# EAGLE design pypl_v1.4 (EAGLE 9.6.2)
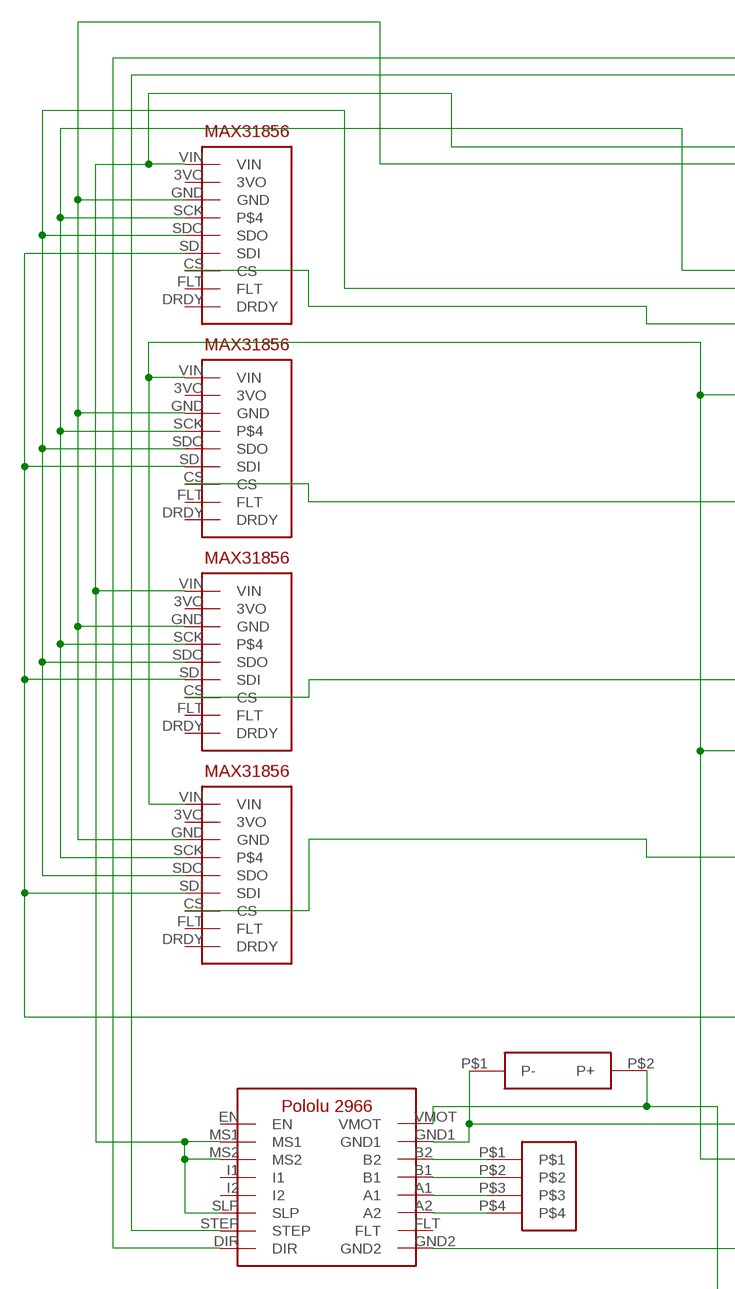
[diagram p0: schematic, sheet 1, part 1 of 2]
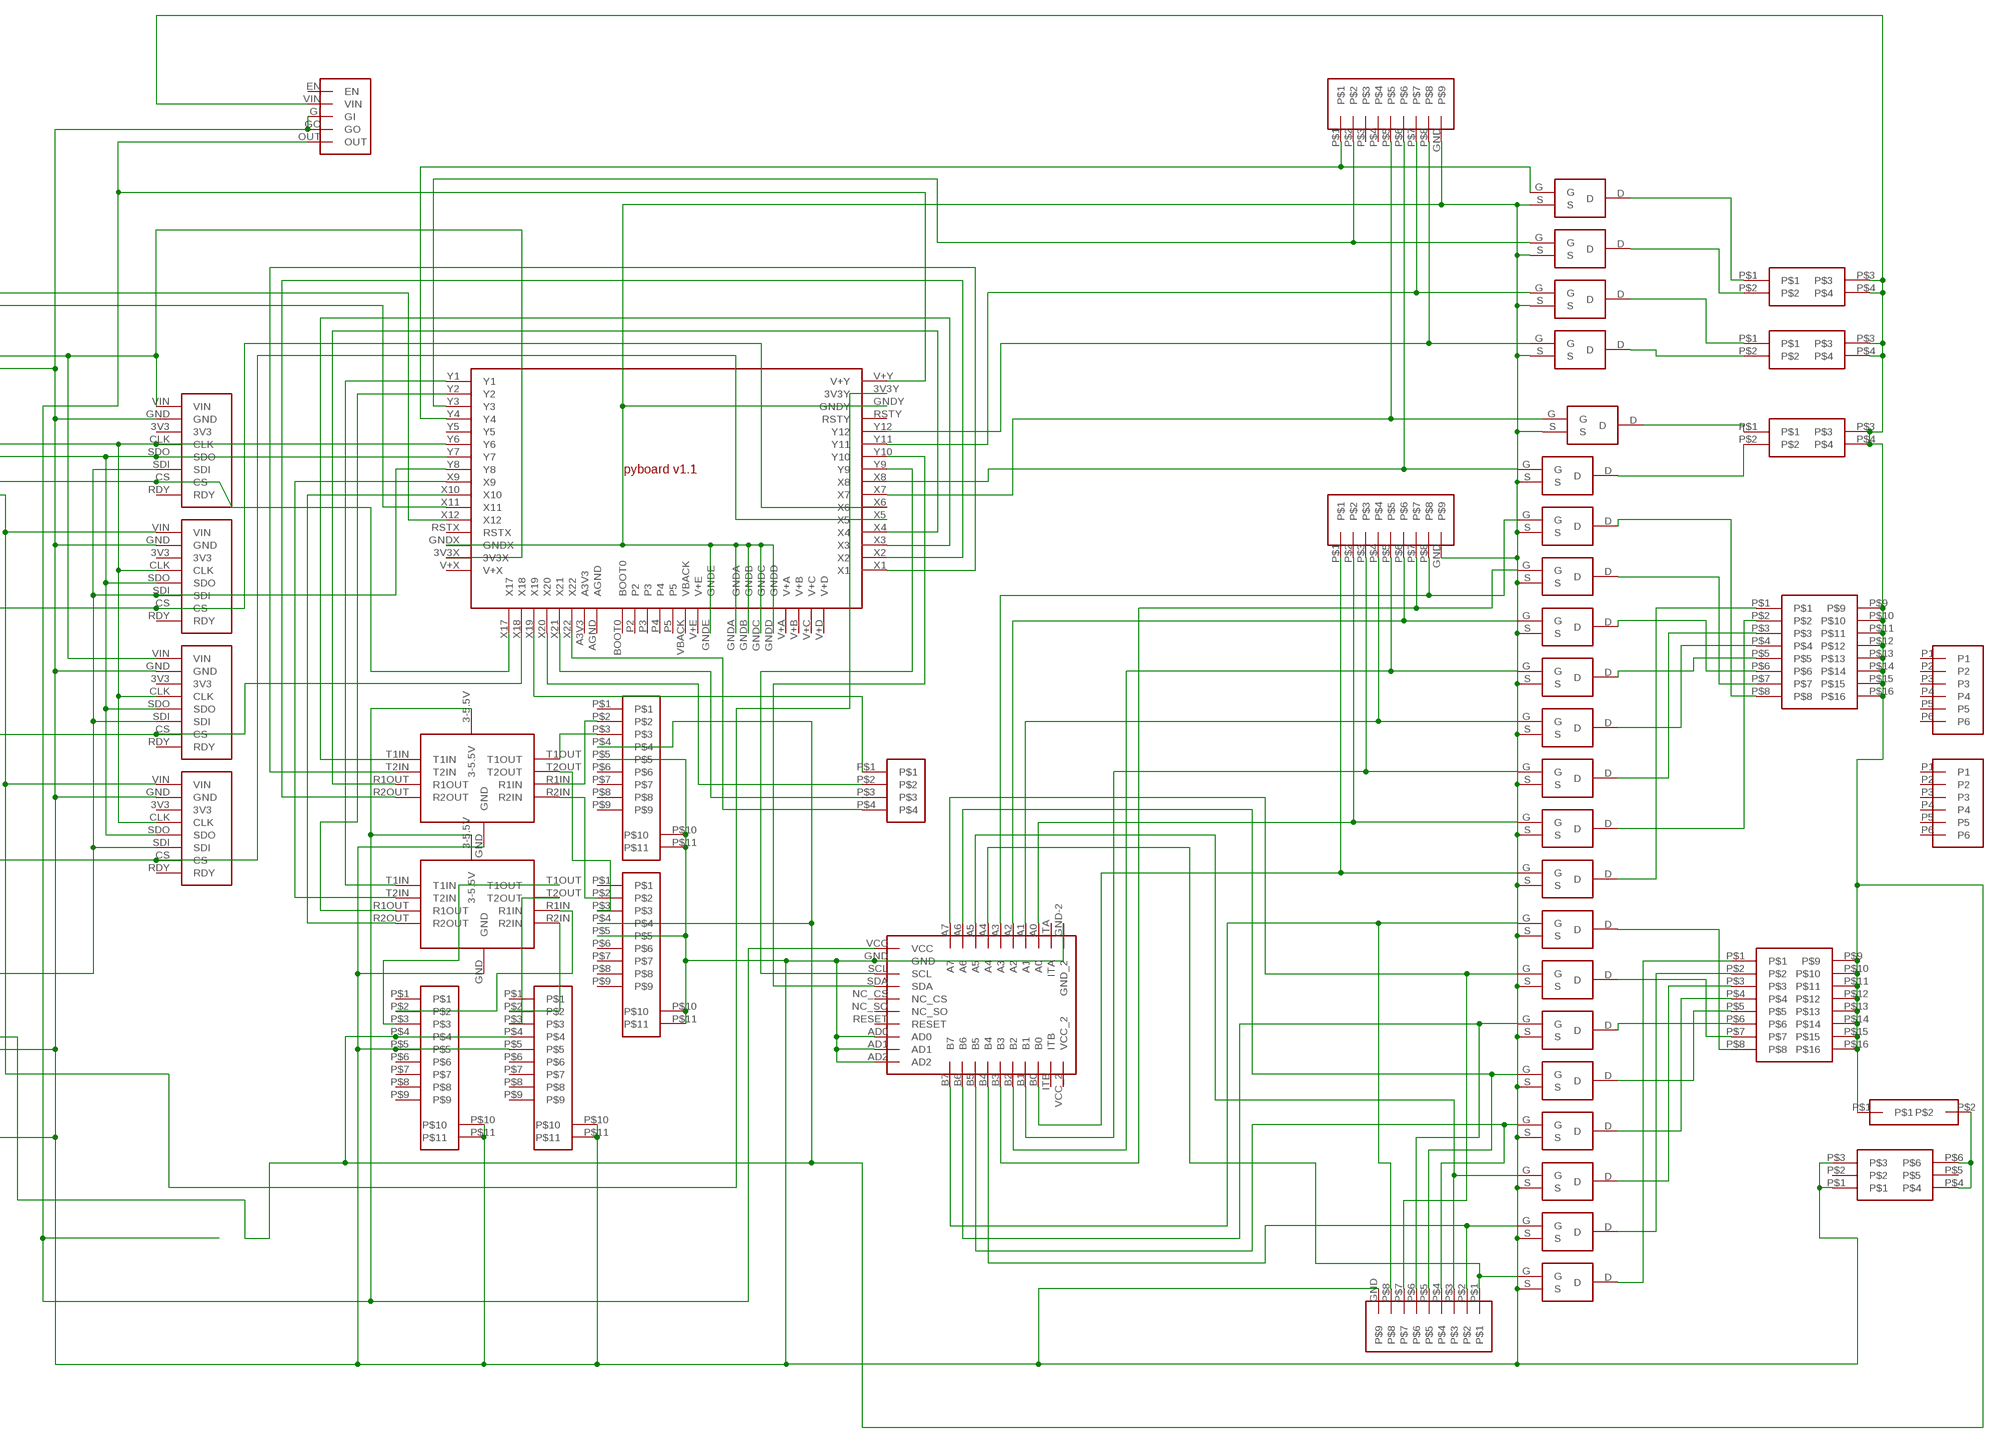
[diagram p1: schematic, sheet 1, part 2 of 2]

## Parts
U$1  MAX31865  [MAX31865]
U$2  IRLB8721PBF  [IRLB8721PBF]
U$3  IRLB8721PBF  [IRLB8721PBF]
U$4  IRLB8721PBF  [IRLB8721PBF]
U$5  IRLB8721PBF  [IRLB8721PBF]
U$6  IRLB8721PBF  [IRLB8721PBF]
U$7  IRLB8721PBF  [IRLB8721PBF]
U$8  IRLB8721PBF  [IRLB8721PBF]
U$9  IRLB8721PBF  [IRLB8721PBF]
U$10  MCP23017  [MCP23017]
U$11  IRLB8721PBF  [IRLB8721PBF]
U$12  IRLB8721PBF  [IRLB8721PBF]
U$13  IRLB8721PBF  [IRLB8721PBF]
U$14  IRLB8721PBF  [IRLB8721PBF]
U$15  IRLB8721PBF  [IRLB8721PBF]
U$16  IRLB8721PBF  [IRLB8721PBF]
U$17  IRLB8721PBF  [IRLB8721PBF]
U$18  IRLB8721PBF  [IRLB8721PBF]
U$19  DSUB-9  [DSUB-9]
U$20  DSUB-9  [DSUB-9]
U$21  DSUB-9  [DSUB-9]
U$22  DSUB-9  [DSUB-9]
U$23  MAX31865  [MAX31865]
U$24  PYBOARD_V1.1  [PYBOARD_V1.1]
U$25  MAX31865  [MAX31865]
U$26  MAX31865  [MAX31865]
U$27  BORNIER_DUPLEX_X16  [BORNIER_DUPLEX_X16]
U$28  BORNIER_DUPLEX_X16  [BORNIER_DUPLEX_X16]
U$29  CAP-GOTRONIC-04936  [CAP-GOTRONIC-04936]
U$30  BORNIER_1X4_2.54  [BORNIER_1X4_2.54]
U$31  PORTE-FUSIBLE  [PORTE-FUSIBLE]
U$32  MP6500-2966  [MP6500-2966]
U$33  IRLB8721PBF  [IRLB8721PBF]
U$34  IRLB8721PBF  [IRLB8721PBF]
U$35  BORNIER_DUPLEX_X4  [BORNIER_DUPLEX_X4]
U$36  BOB-1189  [BOB-11189]
U$37  BOB-1189  [BOB-11189]
U$38  MOLEX_MINIFT_JR_ANGLED_X6  [MOLEX_MINIFT_JR_ANGLED_X6]
U$39  D24V50F5D24V50F5  [D24V50F5]
U$40  BORNIER_DUPLEX_X4  [BORNIER_DUPLEX_X4]
U$41  BORNIER_DUPLEX_X4  [BORNIER_DUPLEX_X4]
U$42  IRLB8721PBF  [IRLB8721PBF]
U$43  IRLB8721PBF  [IRLB8721PBF]
U$44  IRLB8721PBF  [IRLB8721PBF]
U$45  IRLB8721PBF  [IRLB8721PBF]
U$46  BORNIER_1X4_2.54  [BORNIER_1X4_2.54]
U$47  RESISTOR_BANK_BUSSED_X8  [RESISTOR_BANK_BUSSED_X8]
U$48  RESISTOR_BANK_BUSSED_X8  [RESISTOR_BANK_BUSSED_X8]
U$49  RESISTOR_BANK_BUSSED_X8  [RESISTOR_BANK_BUSSED_X8]
U$50  MAX31856  [MAX31856]
U$51  MAX31856  [MAX31856]
U$52  MAX31856  [MAX31856]
U$53  MAX31856  [MAX31856]
U$54  PINH06  [PINH06]
U$55  PINH06  [PINH06]

## Nets
GND: U$1.GND U$2.S U$3.S U$4.S U$5.S U$6.S U$7.S U$8.S U$9.S U$10.AD0 U$10.AD1 U$10.AD2 U$10.GND U$10.GND-2(GND_2) U$11.S U$12.S U$13.S U$14.S U$15.S U$16.S U$17.S U$18.S U$19.P$5 U$19.P$10 U$19.P$11 U$20.P$5 U$20.P$10 U$20.P$11 U$21.P$5 U$21.P$10 U$21.P$11 U$22.P$5 U$22.P$10 U$22.P$11 U$23.GND U$24.GNDA U$24.GNDB U$24.GNDC U$24.GNDD U$24.GNDE U$24.GNDX U$24.GNDY U$25.GND U$26.GND U$29.P$1(P-) U$32.GND1 U$32.GND2 U$33.S U$34.S U$36.GND U$37.GND U$38.P$1 U$38.P$3 U$39.GI U$39.GO U$42.S U$43.S U$44.S U$45.S U$47.GND U$48.GND U$49.GND U$50.GND U$51.GND U$52.GND U$53.GND
N$1: U$24.X12 U$32.DIR
N$2: U$10.SDA U$24.Y10
N$3: U$10.SCL U$24.Y9
N$4: U$24.X4 U$36.R1OUT
N$5: U$24.X3 U$36.T1IN
N$6: U$24.X2 U$36.R2OUT
N$7: U$24.X1 U$36.T2IN
N$8: U$24.Y1 U$37.T1IN
N$9: U$24.Y2 U$37.R1OUT
N$10: U$24.X10 U$37.R2OUT
N$11: U$24.X9 U$37.T2IN
N$12: U$1.CLK U$23.CLK U$24.Y6 U$25.CLK U$26.CLK U$50.SCK U$51.SCK U$52.SCK U$53.SCK
N$13: U$1.SDO U$23.SDO U$24.Y7 U$25.SDO U$26.SDO U$50.SDO U$51.SDO U$52.SDO U$53.SDO
N$14: U$1.SDI U$23.SDI U$24.Y8 U$25.SDI U$26.SDI U$50.SDI U$51.SDI U$52.SDI U$53.SDI
N$15: U$10.A7 U$15.G U$47.P$7
N$16: U$4.G U$10.B2 U$48.P$5
N$17: U$7.G U$10.A3 U$48.P$8
N$18: U$6.G U$10.B3 U$48.P$7
N$19: U$5.G U$10.A2 U$48.P$6
N$20: U$3.G U$10.A1 U$48.P$4
N$21: U$2.G U$10.B1 U$48.P$3
N$22: U$8.G U$10.A0 U$48.P$2
N$23: U$9.G U$10.B0 U$48.P$1
N$24: U$10.B4 U$17.G U$47.P$2
N$26: U$10.B5 U$12.G U$47.P$4
N$27: U$10.B6 U$14.G U$47.P$6
N$28: U$10.B7 U$16.G U$47.P$8
N$30: U$10.A6 U$13.G U$47.P$5
N$31: U$7.D U$28.P$8
N$32: U$6.D U$28.P$7
N$33: U$5.D U$28.P$6
N$34: U$30.P$1 U$32.B2
N$35: U$16.D U$27.P$8
N$36: U$15.D U$27.P$7
N$37: U$4.D U$28.P$5
N$38: U$3.D U$28.P$4
N$39: U$2.D U$28.P$3
N$40: U$8.D U$28.P$2
N$41: U$9.D U$28.P$1
N$42: U$14.D U$27.P$6
N$43: U$13.D U$27.P$5
N$44: U$12.D U$27.P$4
N$45: U$11.D U$27.P$3
N$46: U$17.D U$27.P$2
N$47: U$18.D U$27.P$1
N$48: U$24.X19 U$46.P$1
N$49: U$40.P$2 U$42.D
N$50: U$10.VCC U$24.V+Y U$36.3-5.5V U$37.3-5.5V U$39.OUT
N$51: U$31.P$2 U$38.P$4 U$38.P$6
N$52: U$24.X6 U$26.CS U$51.CS
N$53: U$1.CS U$24.X18 U$52.CS
N$54: U$24.X17 U$25.CS U$50.CS
N$55: U$24.X7 U$34.G U$49.P$5
N$56: U$24.X8 U$33.G U$49.P$6
N$57: U$33.D U$35.P$2
N$58: U$34.D U$35.P$1
N$59: U$30.P$2 U$32.B1
N$60: U$30.P$3 U$32.A1
N$61: U$30.P$4 U$32.A2
N$62: U$19.P$2 U$36.R1IN
N$63: U$20.P$2 U$36.R2IN
N$64: U$40.P$1 U$43.D
N$65: U$21.P$2 U$37.R2IN
N$66: U$22.P$2 U$37.R1IN
N$67: U$19.P$3 U$36.T1OUT
N$68: U$20.P$3 U$36.T2OUT
N$69: U$22.P$3 U$37.T1OUT
N$70: U$21.P$3 U$37.T2OUT
N$71: U$1.VIN U$24.3V3X U$25.VIN U$32.MS1 U$32.MS2 U$32.SLP U$50.VIN U$52.VIN
N$72: U$23.CS U$24.X5 U$53.CS
N$73: U$41.P$2 U$44.D
N$74: U$23.VIN U$24.3V3Y U$26.VIN U$51.VIN U$53.VIN
N$75: U$19.P$4 U$20.P$4 U$21.P$4 U$22.P$4 U$27.P$9 U$27.P$10 U$27.P$11 U$27.P$12 U$27.P$13 U$27.P$14 U$27.P$15 U$27.P$16 U$28.P$9 U$28.P$10 U$28.P$11 U$28.P$12 U$28.P$13 U$28.P$14 U$28.P$15 U$28.P$16 U$29.P$2(P+) U$31.P$1 U$32.VMOT U$35.P$3 U$35.P$4 U$39.VIN U$40.P$3 U$40.P$4 U$41.P$3 U$41.P$4
N$76: U$24.X20 U$46.P$2
N$77: U$24.X21 U$46.P$3
N$78: U$24.X22 U$46.P$4
N$79: U$24.X11 U$32.STEP
N$80: U$10.A5 U$11.G U$47.P$3
N$81: U$41.P$1 U$45.D
N$82: U$24.Y11 U$43.G U$49.P$7
N$83: U$24.Y12 U$42.G U$49.P$8
N$84: U$24.Y3 U$44.G U$49.P$2
N$85: U$24.Y4 U$45.G U$49.P$1
N$86: U$10.A4 U$18.G U$47.P$1
Unconnected: U$1.3V3 U$1.RDY U$10.ITA U$10.ITB U$10.NC_CS U$10.NC_SO U$10.RESET U$10.VCC_2 U$19.P$1 U$19.P$6 U$19.P$7 U$19.P$8 U$19.P$9 U$20.P$1 U$20.P$6 U$20.P$7 U$20.P$8 U$20.P$9 U$21.P$1 U$21.P$6 U$21.P$7 U$21.P$8 U$21.P$9 U$22.P$1 U$22.P$6 U$22.P$7 U$22.P$8 U$22.P$9 U$23.3V3 U$23.RDY U$24.A3V3 U$24.AGND U$24.BOOT0 U$24.P2 U$24.P3 U$24.P4 U$24.P5 U$24.RSTX U$24.RSTY U$24.V+A U$24.V+B U$24.V+C U$24.V+D U$24.V+E U$24.V+X U$24.VBACK U$24.Y5 U$25.3V3 U$25.RDY U$26.3V3 U$26.RDY U$32.EN U$32.FLT U$32.I1 U$32.I2 U$38.P$2 U$38.P$5 U$39.EN U$49.P$3 U$49.P$4 U$50.3VO U$50.DRDY U$50.FLT U$51.3VO U$51.DRDY U$51.FLT U$52.3VO U$52.DRDY U$52.FLT U$53.3VO U$53.DRDY U$53.FLT U$54.P1 U$54.P2 U$54.P3 U$54.P4 U$54.P5 U$54.P6 U$55.P1 U$55.P2 U$55.P3 U$55.P4 U$55.P5 U$55.P6

## Library data of the parts
U$1 U$23 U$25 U$26 = mathieu:MAX31865
U$2-U$9 U$11-U$18 U$33 U$34 U$42-U$45 = mathieu:IRLB8721PBF
U$10 = mathieu:MCP23017
U$19-U$22 = mathieu:DSUB-9
U$24 = mathieu:PYBOARD_V1.1
U$27 U$28 = mathieu:BORNIER_DUPLEX_X16
U$29 = mathieu:CAP-GOTRONIC-04936
U$30 U$46 = mathieu:BORNIER_1X4_2.54
U$31 = mathieu:PORTE-FUSIBLE
U$32 = mathieu:MP6500-2966
U$35 U$40 U$41 = mathieu:BORNIER_DUPLEX_X4
U$36 U$37 = mathieu:BOB-1189
U$38 = mathieu:MOLEX_MINIFT_JR_ANGLED_X6
U$39 = mathieu:D24V50F5
U$47-U$49 = mathieu:RESISTOR_BANK_BUSSED_X8
U$50-U$53 = mathieu:MAX31856
U$54 U$55 = mathieu:PINH06

## Board
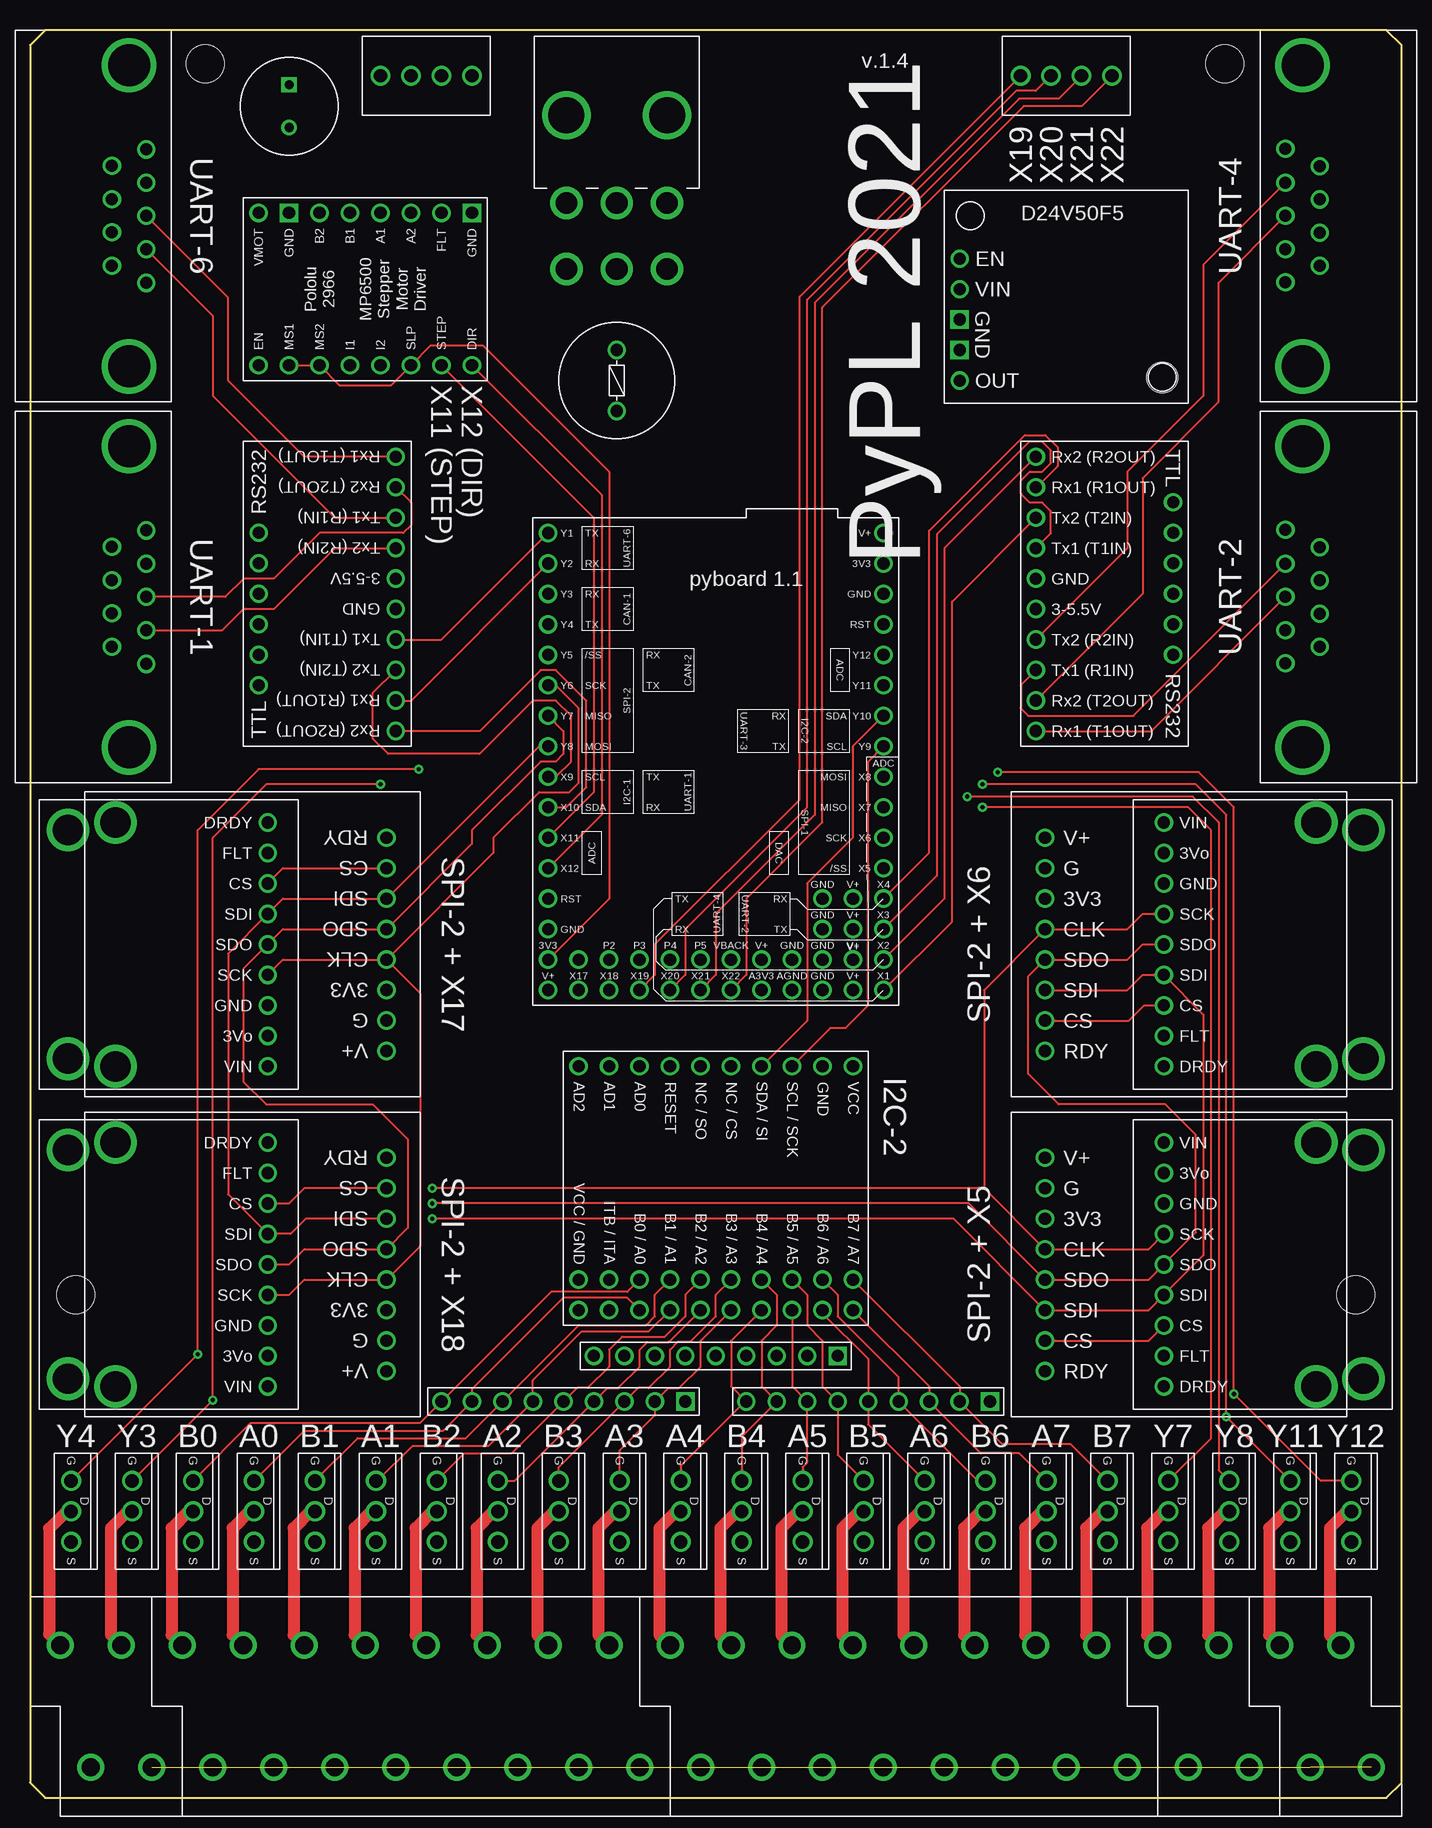
[diagram p2: board, top side]
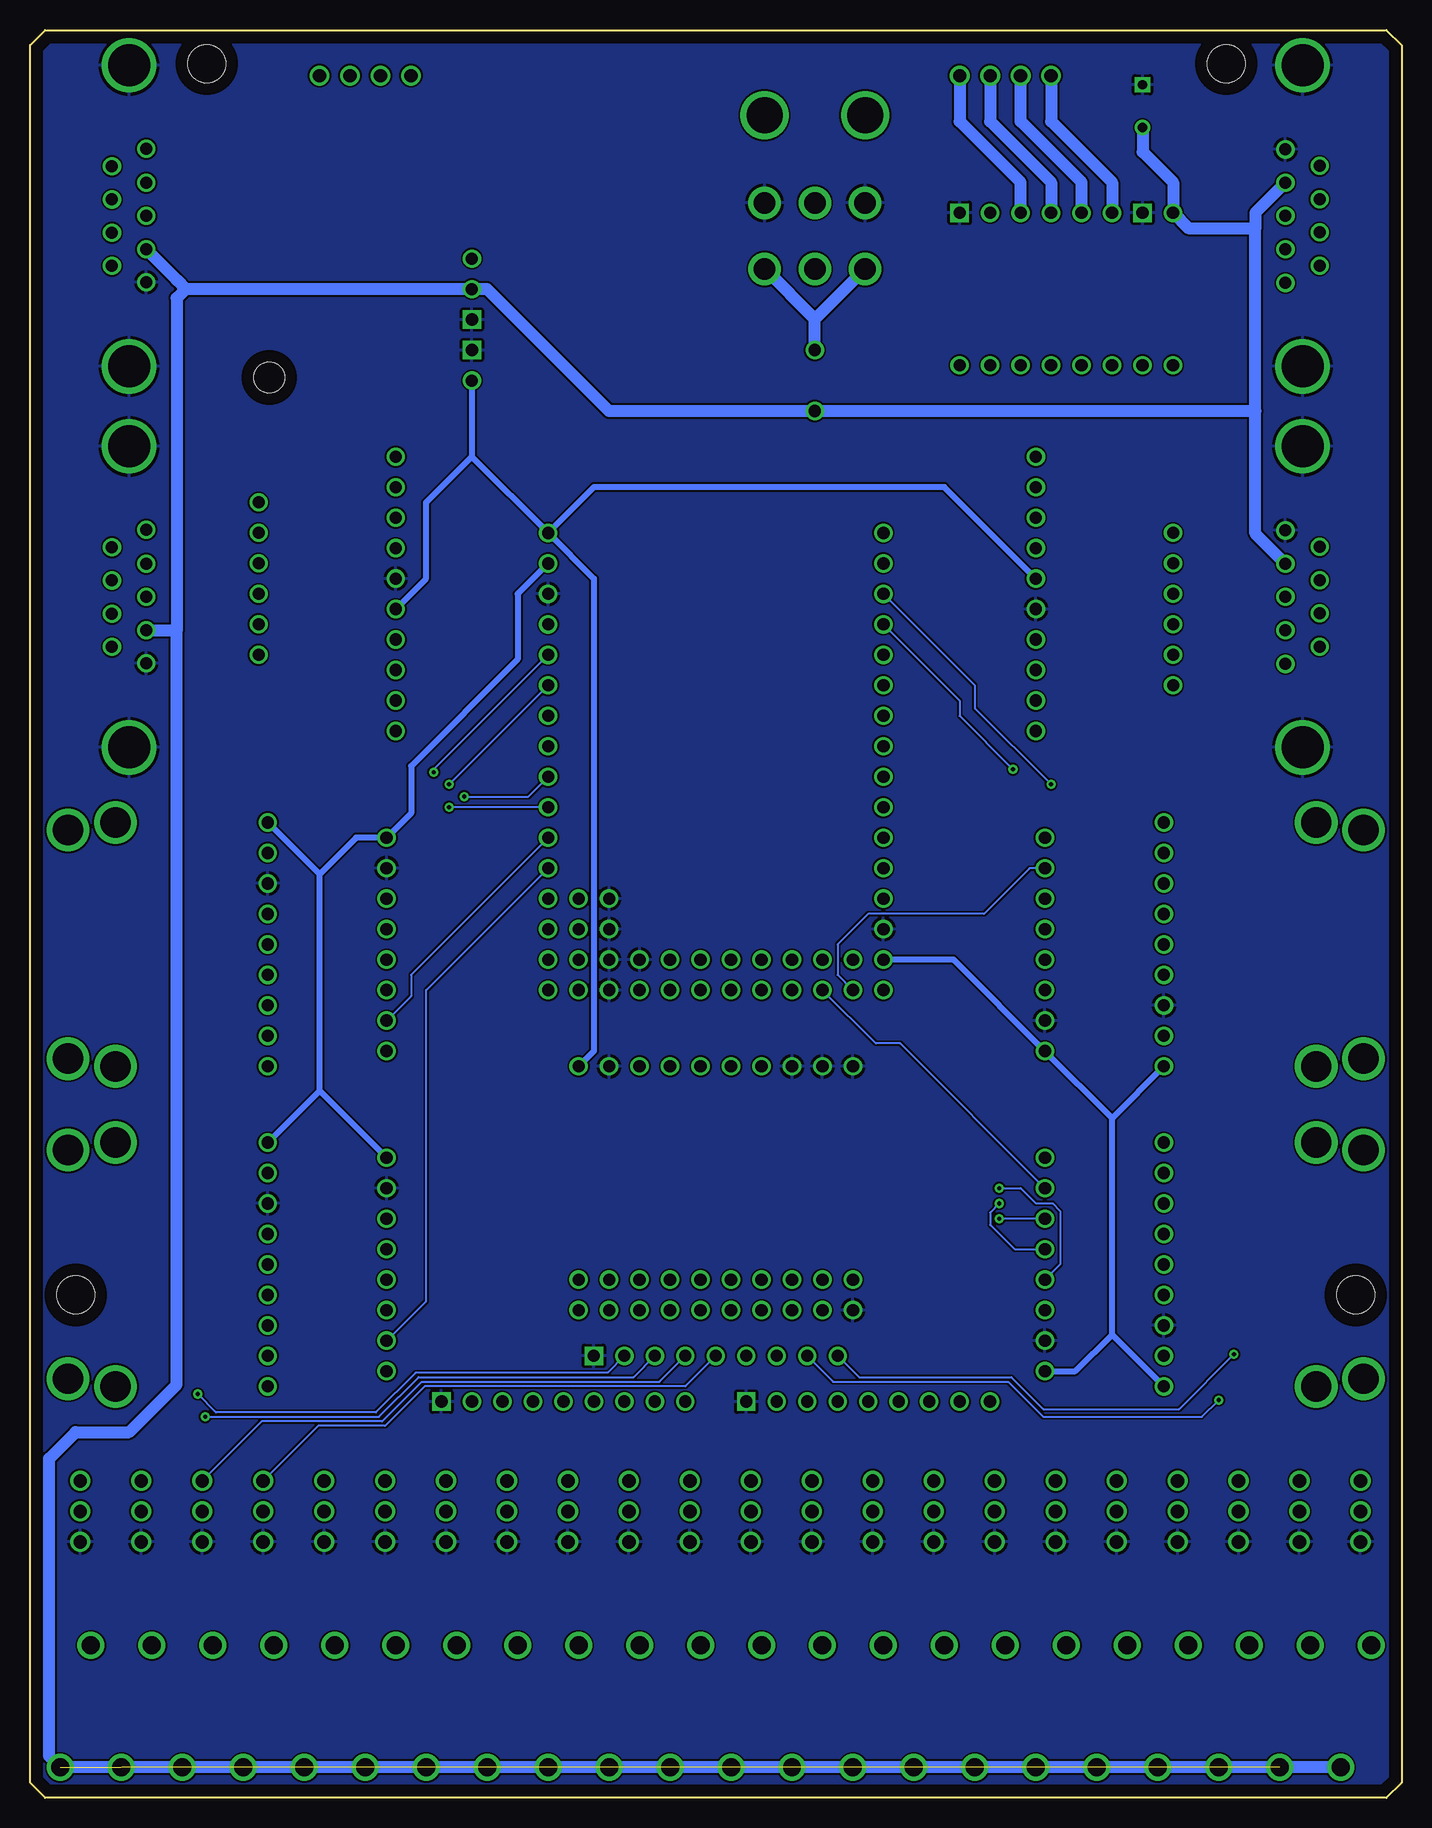
[diagram p3: board, bottom side, seen from below]

Size 114.3 x 147.32 mm. Coordinates in mm from the lower left corner, seen from the top.
Outline: 0,146.05 0,1.27 1.27,0 113.03,0 114.3,1.27 114.3,146.05 113.03,147.32 1.27,147.32 0,146.05
Copper layers (1*16): Top 0.035mm / dielectric 1.5mm / Bottom 0.035mm
Design rules "default": minimum track width 6mil, minimum drill 0.35mm, track to track 6mil, track to pad 6mil, pad to pad 6mil, via to via 6mil, smd to smd 6mil, copper to edge 40mil, drill to drill 6mil, minimum pad ring 10mil, minimum via ring 8mil, stop-mask expansion 4mil, vias tented up to drill 0mil, thermal gap 10mil
Holes 3.15 mm at 14.61,144.53 99.57,144.53 3.81,41.91 110.49,41.91
Holes 2.54 mm at 94.36,118.36

### Footprints (pad centres in the part's own frame; a part is rotated, then mirrored left to right if it is on the bottom)
MAX31865 = drill 1.02: 3V3 -3.81,-11.176; CLK -1.27,-11.176; CS 6.35,-11.176; GND -6.35,-11.176; RDY 8.89,-11.176; SDI 3.81,-11.176; SDO 1.27,-11.176; VIN -8.89,-11.176 | drill 2.54: P$1 -10.16,11.43; P$2 10.16,11.43
IRLB8721PBF = drill 1.118: D 0,0; G -2.54,0; S 2.54,0
MCP23017 = drill 1.02: A0 8.89,-6.35; A1 8.89,-3.81; A2 8.89,-1.27; A3 8.89,1.27; A4 8.89,3.81; A5 8.89,6.35; A6 8.89,8.89; A7 8.89,11.43; AD0 -11.43,-6.35; AD1 -11.43,-8.89; AD2 -11.43,-11.43; B0 6.35,-6.35; B1 6.35,-3.81; B2 6.35,-1.27; B3 6.35,1.27; B4 6.35,3.81; B5 6.35,6.35; B6 6.35,8.89; B7 6.35,11.43; GND -11.43,8.89; GND-2 8.89,-11.43; ITA 8.89,-8.89; ITB 6.35,-8.89; NC_CS -11.43,1.27; NC_SO -11.43,-1.27; RESET -11.43,-3.81; SCL -11.43,6.35; SDA -11.43,3.81; VCC -11.43,11.43; VCC_2 6.35,-11.43
DSUB-9 = drill 1: P$1 5.588,1.422; P$2 2.769,1.422; P$3 0,1.422; P$4 -2.769,1.422; P$5 -5.537,1.422; P$6 4.14,-1.422; P$7 1.372,-1.422; P$8 -1.397,-1.422; P$9 -4.166,-1.422 | drill 3.5: P$10 -12.548,0; P$11 12.548,0
PYBOARD_V1.1 = drill 1.02: 3V3X -13.97,-16.51; 3V3Y 13.97,16.51; A3V3 3.81,-19.05; AGND 6.35,-19.05; BOOT0 -11.43,-16.51; GNDA 8.89,-11.43; GNDB 8.89,-13.97; GNDC 8.89,-16.51; GNDD 8.89,-19.05; GNDE 6.35,-16.51; GNDX -13.97,-13.97; GNDY 13.97,13.97; P2 -8.89,-16.51; P3 -6.35,-16.51; P4 -3.81,-16.51; P5 -1.27,-16.51; RSTX -13.97,-11.43; RSTY 13.97,11.43; V+A 11.43,-11.43; V+B 11.43,-13.97; V+C 11.43,-16.51; V+D 11.43,-19.05; V+E 3.81,-16.51; V+X -13.97,-19.05; V+Y 13.97,19.05; VBACK 1.27,-16.51; X1 13.97,-19.05; X2 13.97,-16.51; X3 13.97,-13.97; X4 13.97,-11.43; X5 13.97,-8.89; X6 13.97,-6.35; X7 13.97,-3.81; X8 13.97,-1.27; X9 -13.97,-1.27; X10 -13.97,-3.81; X11 -13.97,-6.35; X12 -13.97,-8.89; X17 -11.43,-19.05; X18 -8.89,-19.05; X19 -6.35,-19.05; X20 -3.81,-19.05; X21 -1.27,-19.05; X22 1.27,-19.05; Y1 -13.97,19.05; Y2 -13.97,16.51; Y3 -13.97,13.97; Y4 -13.97,11.43; Y5 -13.97,8.89; Y6 -13.97,6.35; Y7 -13.97,3.81; Y8 -13.97,1.27; Y9 13.97,1.27; Y10 13.97,3.81; Y11 13.97,6.35; Y12 13.97,8.89
BORNIER_DUPLEX_X16 = drill 1.499: P$1 -19.05,5.08; P$2 -13.97,5.08; P$3 -8.89,5.08; P$4 -3.81,5.08; P$5 1.27,5.08; P$6 6.35,5.08; P$7 11.43,5.08; P$8 16.51,5.08; P$9 -16.51,-5.08; P$10 -11.43,-5.08; P$11 -6.35,-5.08; P$12 -1.27,-5.08; P$13 3.81,-5.08; P$14 8.89,-5.08; P$15 13.97,-5.08; P$16 19.05,-5.08
CAP-GOTRONIC-04936 = drill 0.762 square: P$1 -1.778,0 | drill 0.762: P$2 1.778,0
BORNIER_1X4_2.54 = drill 1.1: P$1 -3.81,0; P$2 -1.27,0; P$3 1.27,0; P$4 3.81,0
PORTE-FUSIBLE = drill 1.02: P$1 -2.54,0; P$2 2.54,0
MP6500-2966 = drill 1.016: A1 13.97,8.89; A2 13.97,6.35; B1 13.97,11.43; B2 13.97,13.97; DIR 1.27,1.27; EN 1.27,19.05; FLT 13.97,3.81; I1 1.27,11.43; I2 1.27,8.89; MS1 1.27,16.51; MS2 1.27,13.97; SLP 1.27,6.35; STEP 1.27,3.81; VMOT 13.97,19.05 | drill 1.016 square: GND1 13.97,16.51; GND2 13.97,1.27
BORNIER_DUPLEX_X4 = drill 1.499: P$1 -3.81,5.08; P$2 1.27,5.08; P$3 -1.27,-5.08; P$4 3.81,-5.08
BOB-11189 = drill 1.02: 3-5.5V 1.27,-6.35; GND -1.27,-6.35; R1IN 6.35,-6.35; R1OUT -8.89,-6.35; R2IN 3.81,-6.35; R2OUT -11.43,-6.35; T1IN -3.81,-6.35; T1OUT 11.43,-6.35; T2IN -6.35,-6.35; T2OUT 8.89,-6.35
MOLEX_MINIFT_JR_ANGLED_X6 = drill 1.803: P$1 4.191,7.29; P$2 0,7.29; P$3 -4.191,7.29; P$4 4.191,12.802; P$5 0,12.802; P$6 -4.191,12.802 | drill 2.997: P$7 4.191,0; P$8 -4.191,0
D24V50F5 = drill 1: EN -3.175,-8.89; OUT 6.985,-8.89; VIN -0.635,-8.89 | drill 1.016 square: GI 1.905,-8.89; GO 4.445,-8.89
RESISTOR_BANK_BUSSED_X8 = drill 1.02 square: GND 10.16,0 | drill 1.02: P$1 -10.16,0; P$2 -7.62,0; P$3 -5.08,0; P$4 -2.54,0; P$5 0,0; P$6 2.54,0; P$7 5.08,0; P$8 7.62,0
MAX31856 = drill 1.02: 3VO 4.445,2.54; CS 17.145,2.54; DRDY 22.225,2.54; FLT 19.685,2.54; GND 6.985,2.54; SCK 9.525,2.54; SDI 14.605,2.54; SDO 12.065,2.54; VIN 1.905,2.54 | drill 2.54: P$1 2.54,19.177; P$2 21.59,19.177
PINH06 = drill 1: P1 -6.35,0; P2 -3.81,0; P3 -1.27,0; P4 1.27,0; P5 3.81,0; P6 6.35,0

### Placement (x,y rotation side)
U$1  18.54,44.45 90 top
U$2  23.75,23.88 270 top
U$3  28.83,23.88 270 top
U$4  33.91,23.88 270 top
U$5  38.99,23.88 270 top
U$6  44.07,23.88 270 top
U$7  49.15,23.88 270 top
U$8  18.67,23.88 270 top
U$9  13.59,23.88 270 top
U$10  57.15,49.53 270 top
U$11  64.39,23.88 270 top
U$12  69.47,23.88 270 top
U$13  74.55,23.88 270 top
U$14  79.63,23.88 270 top
U$15  84.71,23.88 270 top
U$16  89.79,23.88 270 top
U$17  59.31,23.88 270 top
U$18  54.23,23.88 270 top
U$19  106.05,100.08 90 top
U$20  106.05,131.83 90 top
U$21  8.26,100.08 270 top
U$22  8.26,131.83 270 top
U$23  95.76,44.45 270 top
U$24  57.15,86.36 0 top
U$25  18.54,71.12 90 top
U$26  95.76,71.12 270 top
U$27  72.39,7.62 0 top
U$28  31.75,7.62 0 top
U$29  21.59,140.97 270 top
U$30  33.02,143.51 0 top
U$31  48.9,118.11 90 top
U$32  38.1,118.11 90 top
U$33  99.95,23.88 270 top
U$34  94.87,23.88 270 top
U$35  97.79,7.62 0 top
U$36  90.17,100.33 270 top
U$37  24.13,100.33 90 top
U$38  48.9,140.21 180 top
U$39  86.36,125.09 270 top
U$40  107.95,7.62 0 top
U$41  6.35,7.62 0 top
U$42  110.11,23.88 270 top
U$43  105.03,23.88 270 top
U$44  8.51,23.88 270 top
U$45  3.43,23.88 270 top
U$46  86.36,143.51 0 top
U$47  69.85,33.02 0 top
U$48  44.45,33.02 0 top
U$49  57.15,36.83 0 top
U$50  22.35,59.05 90 top
U$51  91.95,83.19 270 top
U$52  22.35,32.38 90 top
U$53  91.95,56.52 270 top
U$54  95.25,101.6 90 top
U$55  19.05,99.06 90 top

### Tracks (layer width: path | path; a pad name or v marks a point on that pad's centre or on a via)
GND
  pour Bottom: -3.81,149.86 116.84,149.86 116.84,-2.54 116.84,-3.81 -2.54,-3.81 -3.81,-3.81
N$1
  Top 0.152: U$32.DIR 47.62,108.58 47.62,81.92 U$24.X12
N$2
  Top 0.152: U$24.Y10 68.58,87.63 68.58,80.01 64.77,76.2 64.77,64.77 U$10.SDA
N$3
  Top 0.152: U$24.Y9 69.85,86.36 69.85,66.04 67.94,64.14 66.67,64.14 U$10.SCL
N$4
  Top 0.152: U$24.X4 74.93,78.74 74.93,105.59 82.9,113.57 84.61,113.57 85.63,112.55 85.63,110.97 83.88,109.22 U$36.R1OUT
N$5
  Top 0.152: U$24.X3 75.56,76.83 75.56,105.29 83.28,113.01 84.36,113.01 85.07,112.3 85.07,111.22 84.36,110.51 83.33,110.51 82.57,109.76 82.57,108.68 83.33,107.93 84.36,107.93 85.07,107.22 85.07,105.38 U$36.T1IN
N$6
  Top 0.152: U$24.X2 76.2,74.93 76.2,104.14 U$36.R2OUT
N$7
  Top 0.152: U$36.T2IN 76.83,99.69 76.83,73.03 U$24.X1
N$8
  Top 0.152: U$24.Y1 34.29,96.52 U$37.T1IN
N$9
  Top 0.152: U$24.Y2 31.75,91.44 U$37.R1OUT
N$10
  Top 0.152: U$24.X10 44.7,82.55 46.35,84.2 46.35,91.44 43.81,93.98 42.55,93.98 37.47,88.9 U$37.R2OUT
N$11
  Top 0.152: U$24.X9 43.81,85.09 45.09,86.36 45.09,90.17 43.81,91.44 41.91,91.44 37.47,87 29.84,87 28.57,88.27 28.57,92.08 U$37.T2IN
N$12  (via drill 0.35)
  Top 0.152: U$25.CLK 38.61,78.74 38.61,80.01 42.42,83.82 44.96,83.82 45.72,84.58 45.72,90.81 43.81,92.71 U$24.Y6 | U$25.CLK 32.51,67.06 32.51,45.97 U$1.CLK 22.86,43.18 21.59,41.91 U$52.SCK | 79.5,50.8 79.5,67.31 U$26.CLK 91.44,72.39 92.71,73.66 U$51.SCK | U$50.SCK 21.08,69.85 U$25.CLK | U$53.SCK 93.22,45.72 U$23.CLK 79.5,50.8 | 79.5,50.8 v33.53,50.8
  Bottom 0.152: v33.53,50.8 31.75,50.8 30.48,49.53 29.08,49.53 28.45,48.9 28.45,44.45 U$1.CLK
N$13  (via drill 0.35)
  Top 0.152: U$24.Y7 44.45,88.9 44.45,87 43.81,86.36 42.55,86.36 36.83,80.64 36.83,79.5 U$25.SDO 21.08,72.39 U$50.SDO 17.78,69.09 17.78,59.69 19.68,57.78 28.57,57.78 31.5,54.86 31.5,47.5 U$1.SDO 22.86,45.72 21.59,44.45 U$52.SDO | U$51.SDO 92.71,71.12 91.44,69.85 U$26.SDO 83.19,68.45 83.19,60.33 85.72,57.78 94.61,57.78 97.16,55.24 97.16,47.12 U$53.SDO 93.22,43.18 U$23.SDO 78.23,49.53 v33.53,49.53
  Bottom 0.152: v33.53,49.53 34.29,48.77 34.29,47.75 32.26,45.72 U$1.SDO
N$14  (via drill 0.35)
  Top 0.152: U$24.Y8 42.42,87.63 U$25.SDI 21.08,74.93 U$50.SDI 16.51,70.36 16.51,50.29 U$52.SDI 21.72,46.99 22.99,48.26 U$1.SDI | U$26.SDI 91.44,67.31 92.71,68.58 U$51.SDI 97.79,65.28 97.79,45.21 U$53.SDI 93.22,40.64 U$23.SDI 76.96,48.26 v33.53,48.26
  Bottom 0.152: U$1.SDI v33.53,48.26
N$15
  Top 0.152: U$10.A7 74.93,34.29 U$47.P$7 79.25,28.7 82.42,28.7 U$15.G
N$16
  Top 0.152: U$4.G 36.2,28.7 40.13,28.7 U$48.P$5 45.59,34.16 46.48,34.16 48.26,35.94 48.26,37.35 49.34,38.43 52.91,38.43 54.61,40.13 54.61,41.91 U$10.B2
N$17
  Top 0.152: U$7.G 49.15,28.96 52.07,31.88 U$48.P$8 53.21,34.16 54.1,34.16 55.88,35.94 55.88,38.1 U$10.A3
N$18
  Top 0.152: U$6.G 44.07,27.56 U$48.P$7 50.67,34.16 51.56,34.16 53.34,35.94 53.34,37.35 53.99,37.99 55.02,37.99 57.15,40.12 57.15,41.91 U$10.B3
N$19
  Top 0.152: U$5.G 40.39,26.42 U$48.P$6 48.13,34.16 49.02,34.16 50.8,35.94 50.8,37.34 51.44,37.97 53.21,37.97 U$10.A2
N$20
  Top 0.152: U$3.G 28.96,26.42 31.88,29.34 38.23,29.34 U$48.P$4 41.91,34.8 45.97,38.86 51.56,38.86 U$10.A1
N$21
  Top 0.152: U$2.G 27.3,29.97 36.32,29.97 U$48.P$3 45.74,39.4 51.33,39.4 52.07,40.13 52.07,41.91 U$10.B1
N$22
  Top 0.152: U$8.G 22.86,30.61 34.42,30.61 U$48.P$2 36.83,34.04 44.45,41.66 49.78,41.66 U$10.A0
N$23
  Top 0.152: U$9.G 18.41,31.24 32.51,31.24 U$48.P$1 43.43,42.16 49.78,42.16 U$10.B0
N$24
  Top 0.152: U$17.G 59.31,30.1 U$47.P$2 60.96,34.29 60.96,38.1 62.23,39.37 62.23,41.91 U$10.B4
N$26
  Top 0.152: U$12.G 67.31,28.57 U$47.P$4 66.04,34.29 66.04,38.1 64.77,39.37 64.77,41.91 U$10.B5
N$27
  Top 0.152: U$10.B6 67.31,41.91 67.31,40.13 72.39,35.05 U$47.P$6 78.99,26.42 U$14.G
N$28
  Top 0.152: U$16.G 86.74,29.46 81.03,29.46 U$47.P$8 77.47,34.29 U$10.B7
N$30
  Top 0.152: U$13.G 69.85,31.11 U$47.P$5 69.85,36.58 66.04,40.39 U$10.A6
N$31
  Top 1.016: U$7.D 48.77,23.88 47.37,22.48 47.37,13.59 U$28.P$8
N$32
  Top 1.016: U$6.D 43.69,23.88 42.29,22.48 42.29,13.59 U$28.P$7
N$33
  Top 1.016: U$5.D 38.61,23.88 37.21,22.48 37.21,13.59 U$28.P$6
N$34
  Bottom 1.016: U$30.P$1 29.21,139.7 24.13,134.62 U$32.B2
N$35
  Top 1.016: U$16.D 89.41,23.88 88.01,22.48 88.01,13.59 U$27.P$8
N$36
  Top 1.016: U$15.D 84.33,23.88 82.93,22.48 82.93,13.59 U$27.P$7
N$37
  Top 1.016: U$4.D 33.53,23.88 32.13,22.48 32.13,13.59 U$28.P$5
N$38
  Top 1.016: U$3.D 28.45,23.88 27.05,22.48 27.05,13.59 U$28.P$4
N$39
  Top 1.016: U$2.D 23.37,23.88 21.97,22.48 21.97,13.59 U$28.P$3
N$40
  Top 1.016: U$8.D 18.29,23.88 16.89,22.48 16.89,13.59 U$28.P$2
N$41
  Top 1.016: U$9.D 13.21,23.88 11.81,22.48 11.81,13.59 U$28.P$1
N$42
  Top 1.016: U$14.D 79.25,23.88 77.85,22.48 77.85,13.59 U$27.P$6
N$43
  Top 1.016: U$13.D 74.17,23.88 72.77,22.48 72.77,13.59 U$27.P$5
N$44
  Top 1.016: U$12.D 69.09,23.88 67.69,22.48 67.69,13.59 U$27.P$4
N$45
  Top 1.016: U$11.D 64.01,23.88 62.61,22.48 62.61,13.59 U$27.P$3
N$46
  Top 1.016: U$17.D 58.93,23.88 57.53,22.48 57.53,13.59 U$27.P$2
N$47
  Top 1.016: U$18.D 53.85,23.88 52.45,22.48 52.45,13.59 U$27.P$1
N$48
  Top 0.152: U$24.X19 52.07,68.58 52.07,71.12 64.14,83.19 64.14,125.09 U$46.P$1
N$49
  Top 1.016: U$42.D 109.73,23.88 108.33,22.48 108.33,13.59 U$40.P$2
N$50
  Bottom 0.508: U$39.OUT 77.47,111.76 | 77.47,111.76 U$24.V+Y | U$36.3-5.5V 81.28,101.6 81.28,107.95 77.47,111.76 | U$37.3-5.5V 38.1,109.22 67.31,109.22 U$24.V+Y | U$24.V+Y 67.31,101.6 67.31,62.23 U$10.VCC
N$51
  Bottom 1.016: U$31.P$2 48.9,123.22 | 48.9,123.22 U$38.P$4 | U$38.P$6 48.9,123.22
N$52
  Top 0.152: U$26.CS 91.57,64.77 92.84,66.04 U$51.CS
  Bottom 0.152: U$26.CS 82.55,66.8 82.55,68.58 U$24.X6
N$53
  Top 0.152: U$52.CS 21.59,49.53 22.86,50.8 U$1.CS
  Bottom 0.152: U$1.CS 41.78,62.87 43.81,62.87 U$24.X18
N$54
  Top 0.152: U$50.CS 21.08,77.47 U$25.CS
  Bottom 0.152: U$25.CS 30.99,77.47 34.8,73.66 44.45,73.66 46.99,71.12 46.99,68.58 U$24.X17
N$55  (via drill 0.35)
  Top 0.152: U$34.G 98.42,29.97 98.42,80.64 96.52,82.55 v79.38,82.55
  Bottom 0.152: U$24.X7 v79.38,82.55 | U$49.P$5 59.69,34.29 81.41,34.29 84.71,30.99 90.3,30.99 U$34.G
N$56  (via drill 0.35)
  Top 0.152: U$33.G 99.06,27.3 99.06,81.28 96.9,83.44 v78.11,83.44
  Bottom 0.152: v78.11,83.44 72.77,83.44 U$24.X8 | U$49.P$6 61.85,34.67 81.66,34.67 84.96,31.37 95,31.37 U$33.G
N$57
  Top 1.016: U$33.D 99.57,23.88 98.17,22.48 98.17,13.59 U$35.P$2
N$58
  Top 1.016: U$34.D 94.49,23.88 93.09,22.48 93.09,13.59 U$35.P$1
N$59
  Bottom 1.016: U$32.B1 26.67,134.62 31.75,139.7 U$30.P$2
N$60
  Bottom 1.016: U$30.P$3 34.29,139.7 29.21,134.62 U$32.A1
N$61
  Bottom 1.016: U$32.A2 31.75,134.62 36.83,139.7 U$30.P$4
N$62
  Top 0.152: U$36.R1IN 82.55,92.71 82.55,90.81 83.19,90.17 91.95,90.17 U$19.P$2
N$63
  Top 0.152: U$20.P$2 97.79,127.76 97.79,116.84 91.44,110.49 91.44,104.14 U$36.R2IN
N$64
  Top 1.016: U$43.D 104.65,23.88 103.25,22.48 103.25,13.59 U$40.P$1
N$65
  Top 0.152: U$21.P$2 16.03,97.31 17.78,99.06 20.32,99.06 25.4,104.14 U$37.R2IN
N$66
  Top 0.152: U$22.P$2 15.24,123.5 15.24,116.84 25.4,106.68 U$37.R1IN
N$67
  Top 0.152: U$19.P$3 93.45,88.9 U$36.T1OUT
N$68
  Top 0.152: U$36.T2OUT 92.71,100.33 92.71,109.98 99.06,116.33 99.06,126.26 U$20.P$3
N$69
  Top 0.152: U$22.P$3 16.51,124.99 16.51,118.11 22.86,111.76 U$37.T1OUT
N$70
  Top 0.152: U$37.T2OUT 31.75,107.95 31.75,106.05 31.11,105.41 24.13,105.41 20.32,101.6 17.8,101.6 16.28,100.08 U$21.P$3
N$71
  Top 0.152: U$24.3V3X 48.26,74.93 48.26,110.49 37.72,121.03 33.4,121.03 U$32.SLP 30.1,117.73 25.78,117.73 U$32.MS2 U$32.MS1
  Bottom 0.508: U$24.3V3X 37.34,69.85 U$25.VIN 24.13,56.64 | U$50.VIN 24.13,56.64 | U$52.VIN 24.13,38.61 | 24.13,38.61 24.13,56.64 | 24.13,38.61 27.18,35.56 U$1.VIN
N$72
  Top 0.152: U$53.CS 93.22,38.1 U$23.CS
  Bottom 0.152: U$24.X5 81.28,67.31 81.28,41.4 U$23.CS
N$73
  Top 1.016: U$44.D 8.13,23.88 6.73,22.48 6.73,13.59 U$41.P$2
N$74
  Bottom 0.508: U$51.VIN 90.17,76.96 | 90.17,58.93 90.17,76.96 | U$24.3V3Y 73.66,100.33 73.66,94.87 82.55,85.98 82.55,82.04 U$26.VIN 87.12,80.01 90.17,76.96 | U$53.VIN 90.17,58.93 | U$23.VIN 90.17,58.93
N$75  (20 unrouted)
  Bottom 1.016: U$29.P$2 21.59,137.16 19.05,134.62 U$32.VMOT 17.78,130.81 12.19,130.81 | U$22.P$4 12.19,132.08 12.19,130.81 | U$21.P$4 12.19,105.36 12.19,115.57 | 12.19,115.57 12.19,130.81 | U$41.P$3 U$40.P$4 112.7,3.48 112.7,28.27 110.49,30.48 106.05,30.48 102.08,34.44 102.08,97.31 | U$20.P$4 102.08,126.52 | 102.08,126.52 102.06,126.49 | U$19.P$4 102.08,97.31 | 102.08,97.31 102.06,97.33 | 12.19,115.57 U$31.P$1 66.04,115.57 76.2,125.73 U$39.VIN 101.32,125.73 | 101.32,125.73 102.08,124.97 102.08,97.31 | 102.08,126.52 102.08,126.49 101.32,125.73
N$76
  Top 0.152: U$24.X20 54.61,68.58 54.61,72.39 64.77,82.55 64.77,124.84 82.17,142.24 83.82,142.24 U$46.P$2
N$77
  Top 0.152: U$46.P$3 85.72,141.6 82.42,141.6 65.41,124.59 65.41,81.92 57.15,73.66 57.15,68.58 U$24.X21
N$78
  Top 0.152: U$24.X22 59.69,68.58 59.69,74.94 66.04,81.29 66.04,124.21 82.8,140.97 87.63,140.97 U$46.P$4
N$79
  Top 0.152: U$32.STEP 46.99,106.68 46.99,83.82 U$24.X11
N$80
  Top 0.152: U$11.G 64.39,27.56 64.77,27.94 U$47.P$3 63.5,34.29 U$10.A5
N$81
  Top 1.016: U$45.D 3.05,23.88 1.6,22.43 1.6,13.64 U$41.P$1
N$82  (via drill 0.35)
  Top 0.152: U$43.G v99.69,31.75 99.69,81.92 97.16,84.45 v79.38,84.45
  Bottom 0.152: U$24.Y11 v79.38,84.45 | U$49.P$7 64.01,35.05 81.92,35.05 85.22,31.75 v99.69,31.75
N$83  (via drill 0.35)
  Top 0.152: U$42.G 107.57,26.42 v100.33,33.66 100.33,82.55 97.41,85.47 v80.64,85.47
  Bottom 0.152: v80.64,85.47 80.64,85.72 U$24.Y12 | U$49.P$8 66.17,35.43 82.17,35.43 85.47,32.13 98.81,32.13 v100.33,33.66
N$84  (via drill 0.35)
  Top 0.152: U$44.G v15.24,33.15 15.24,80.01 19.68,84.45 v29.21,84.45
  Bottom 0.152: v29.21,84.45 35.56,90.81 35.56,92.71 U$24.Y3 | U$49.P$2 47.37,34.67 32.77,34.67 29.84,31.75 16.64,31.75 v15.24,33.15
N$85  (via drill 0.35)
  Top 0.152: U$45.G v13.97,36.96 13.97,80.64 19.05,85.72 v32.38,85.72
  Bottom 0.152: U$24.Y4 36.83,91.44 36.83,90.17 v32.38,85.72 | U$49.P$1 45.21,35.05 32.51,35.05 29.84,32.38 18.54,32.38 v13.97,36.96
N$86
  Top 0.152: U$18.G 54.23,27.69 59.56,33.02 U$47.P$1 58.42,34.29 58.42,38.1 U$10.A4

### Text on the board
tNames: PyPL 2021 | v.1.4 | X19 | X20 | X21 | X22 | UART-6 | UART-4 | X11 (STEP) | X12 (DIR) | UART-1 | UART-2 | SPI-2 + X17 | SPI-2 + X6 | I2C-2 | SPI-2 + X18 | SPI-2 + X5 | Y4 | Y3 | B0 | A0 | B1 | A1 | B2 | A2 | B3 | A3 | A4 | B4 | A5 | B5 | A6 | B6 | A7 | B7 | Y7 | Y8 | Y11 | Y12